# Altium schematic sheet Mcu.SchDoc: Test
size A4; DrawnBy: Łukasz Przeniosło; Organization: Zachodniopomorski; Address1: Uniwersytet Technologiczny; Address2: w Szczecinie; Address3: Wydział Elektryczny; DocumentNumber: 1111; Revision: 1.0; SheetNumber: 0; SheetTotal: 0
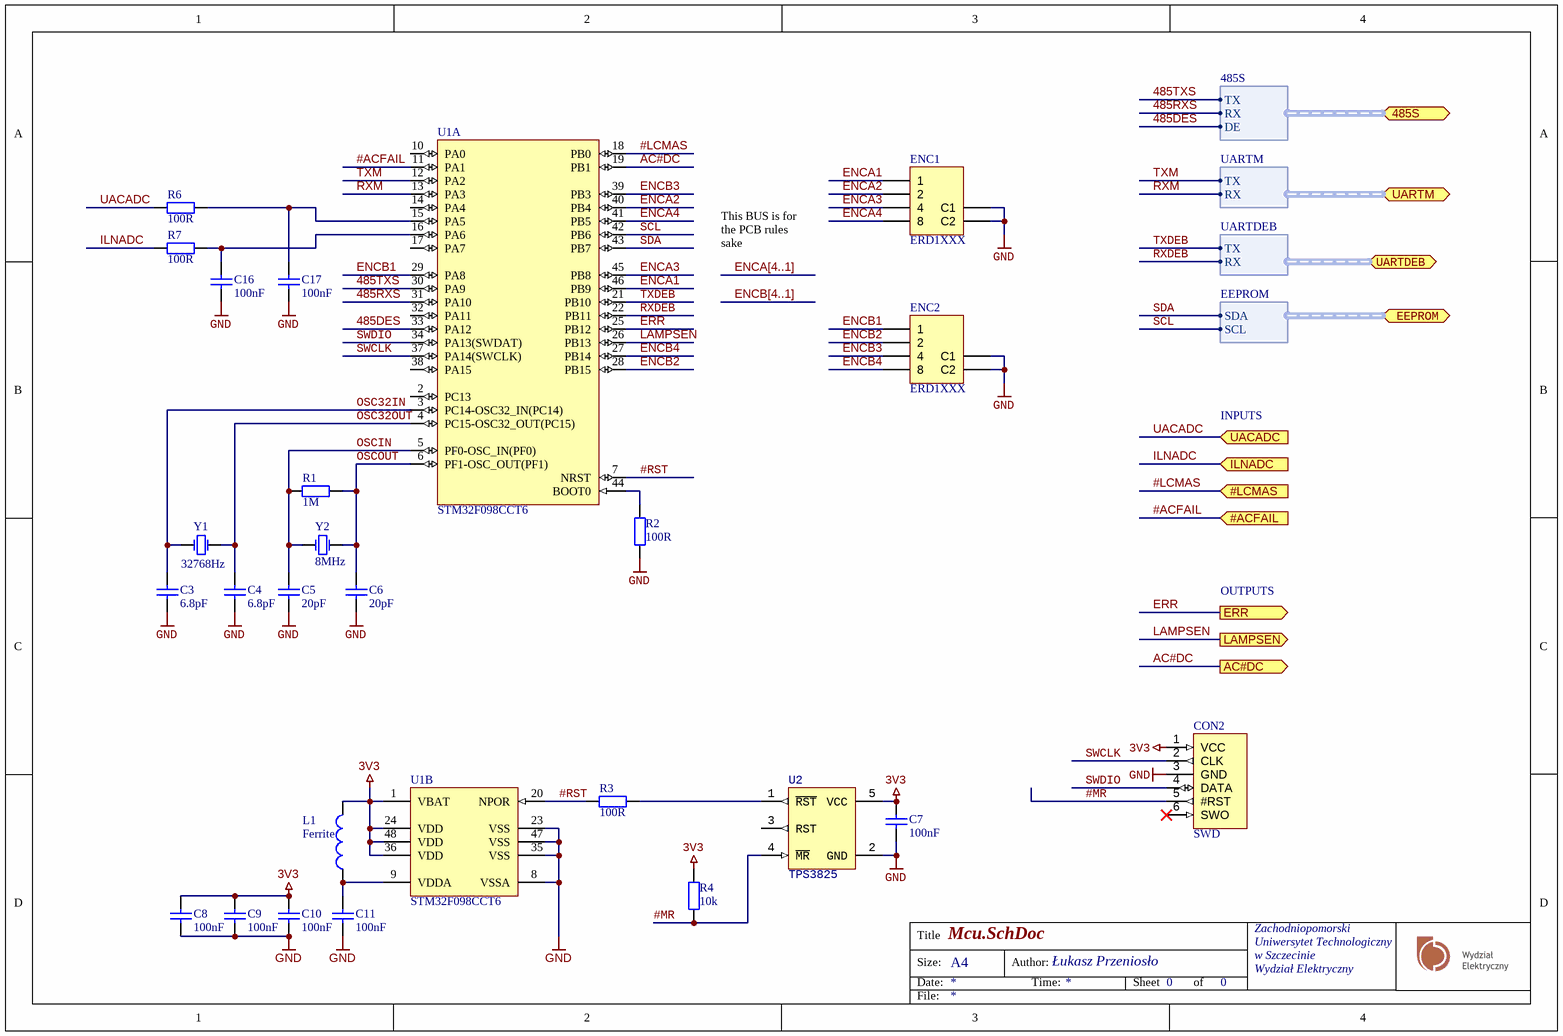
[diagram p0: Mcu.SchDoc]

## Parts
C3  6.8pF  [CAPC1608N]
C4  6.8pF  [CAPC1608N]
C5  20pF  [CAPC1608N]
C6  20pF  [CAPC1608N]
C7  100nF  [CAPC1608N]
C8  100nF  [CAPC1608N]
C9  100nF  [CAPC1608N]
C10  100nF  [CAPC1608N]
C11  100nF  [CAPC1608N]
C16  100nF  [CAPC1608N]
C17  100nF  [CAPC1608N]
CON2  SWD  [HEADER_6]
ENC1  ERD1XXX  [ERD]
ENC2  ERD1XXX  [ERD]
L1  Ferrite  [inductor_0603]
R1  1M  [RESC1608N]
R2  100R  [RESC1608N]
R3  100R  [RESC1608N]
R4  10k  [RESC1608N]
R6  100R  [RESC1608N]
R7  100R  [RESC1608N]
U1  STM32F098CCT6  [LQFP-48_L]  (parts A,B of 2)
U2  TPS3825  [SOT23-5-DBVR]
Y1  32768Hz  [ABS25-crystal]
Y2  8MHz  [HC49/4H_SMX]

## Ports
485S (harness 485S), #ACFAIL (in), #LCMAS (in), AC#DC (out), EEPROM (harness EEPROM), ERR (out), ILNADC (in), LAMPSEN (out), UACADC (in), UARTDEB (harness UARTDEB), UARTM (harness UARTM)

## Harnesses
485S: TX, RX, DE
UARTM: TX, RX
EEPROM: SDA, SCL
UARTDEB: TX, RX

## Nets
3V3: C7.2 C8.2 C9.2 C10.2 CON2.1(VCC) L1.2 R4.1 U1.1(VBAT) U1.24(VDD) U1.36(VDD) U1.48(VDD) U2.5(VCC)
GND: C3.1 C4.1 C5.2 C6.2 C7.1 C8.1 C9.1 C10.1 C11.1 C16.1 C17.2 CON2.3(GND) ENC1.C1 ENC1.C2 ENC2.C1 ENC2.C2 R2.2 U1.8(VSSA) U1.23(VSS) U1.35(VSS) U1.47(VSS) U2.2(GND)
485DES: U1.33(PA12) ; port 485S.DE
485RXS: U1.31(PA10) ; port 485S.RX
485TXS: U1.30(PA9) ; port 485S.TX
#ACFAIL: U1.11(PA1) ; port #ACFAIL
#LCMAS: U1.18(PB0) ; port #LCMAS
#MR: CON2.5(#RST) R4.2 U2.4(~{MR})
#RST: R3.1 U1.7(NRST) U1.20(NPOR)
AC#DC: U1.19(PB1) ; port AC#DC
ENCA1: ENC1.1 U1.46(PB9)
ENCA2: ENC1.2 U1.40(PB4)
ENCA3: ENC1.4 U1.45(PB8)
ENCA4: ENC1.8 U1.41(PB5)
ENCB1: ENC2.1 U1.29(PA8)
ENCB2: ENC2.2 U1.28(PB15)
ENCB3: ENC2.4 U1.39(PB3)
ENCB4: ENC2.8 U1.27(PB14)
ERR: U1.25(PB12) ; port ERR
ILNADC: R7.1 ; port ILNADC
LAMPSEN: U1.26(PB13) ; port LAMPSEN
OSC32IN: C3.2 U1.3(PC14-OSC32_IN(PC14)) Y1.1(OSC1)
OSC32OUT: C4.2 U1.4(PC15-OSC32_OUT(PC15)) Y1.2(OSC2)
OSCIN: C5.1 R1.1 U1.5(PF0-OSC_IN(PF0)) Y2.2(OSC2)
OSCOUT: C6.1 R1.2 U1.6(PF1-OSC_OUT(PF1)) Y2.1(OSC1)
RXDEB: U1.22(PB11) ; port UARTDEB.RX
RXM: U1.13(PA3) ; port UARTM.RX
SCL: U1.42(PB6) ; port EEPROM.SCL
SDA: U1.43(PB7) ; port EEPROM.SDA
SWCLK: CON2.2(CLK) U1.37(PA14(SWCLK))
SWDIO: CON2.4(DATA) U1.34(PA13(SWDAT))
TXDEB: U1.21(PB10) ; port UARTDEB.TX
TXM: U1.12(PA2) ; port UARTM.TX
UACADC: R6.1 ; port UACADC
NetC11_2: C11.2 L1.1 U1.9(VDDA)
NetC16_2: C16.2 R7.2 U1.16(PA6)
NetC17_1: C17.1 R6.2 U1.15(PA5)
NetR2_1: R2.1 U1.44(BOOT0)
NetR3_2: R3.2 U2.1(~{RST})

Not connected (* = marked no-connect by the designer): CON2 6(SWO)*; U1 2(PC13) 10(PA0) 14(PA4) 17(PA7) 32(PA11) 38(PA15); U2 3(RST)

## Buses and harness runs
bus ENCA[4..1]
bus ENCB[4..1]

## Notes on the sheet
- This BUS is for the PCB rules sake
- INPUTS
- OUTPUTS
- Title
- Size:
- Date:
- A4
- Author:
- Time:
- Sheet
- of
- File:

## Library data of the parts
C3-C11 C16 C17 = Capacitor
  C3 C4: Value: 6.8pF
  C5 C6: Value: 20pF
  C7-C11 C16 C17: Value: 100nF
CON2 = SWD-HEADER
L1 = Inductor: Code_IEC: 1005; Value: 10mH; Published: 8-Jun-2000; LatestRevisionDate: 29-May-2009; LatestRevisionNote: IPC-7351 Footprint Added.; PackageReference: 0402-A; Publisher: Altium Limited; PackageDescription: Chip Inductor; Code_JEITA: 0402
R1 = Resistor: Power: 0W; Tolerance: 5%; Value: 1M
R2-R4 R6 R7 = Resistor: Tolerance: 5%; Power: 0W
  R2 R3 R6 R7: Value: 100R
  R4: Value: 10k
U1 = STM32F098CCT6: PartNumber: STM32F051C6T6; Internal RAM Size (kB): 4; Operating Frequency(F) (Processor speed) (MHz): 48; Core: ARM Cortex-M0; FLASH Size (Prog) (kB): 32; Supply Voltage(Vcc) min (V): 2; Packing: Tray; I/Os (High Current): 39; ComponentLink3URL: http://www.st.com/st-web-ui/static/active/en/resource/technical/document/datasheet/DM00058181.pdf; Mounting Technology: Surface Mount; PackageDescription: 48-Pin Low Profile Quad Flat Package, 7 x 7 mm Body, 0.5 mm Pitch; PackageReference: LQFP48; ComponentLink1Description: Manufacturer URL; ComponentLink1URL: http://www.st.com/web/en/home.html; ComponentLink2URL: http://www.st.com/st-web-ui/static/active/en/resource/technical/document/datasheet/DM00039193.pdf; PackageVersion: Rev. 6, 06/2013; ComponentLink2Description: Datasheet; ComponentLink3Description: Package Specification; DatasheetVersion: Rev. 3; PartId: 1
U2 = TPS3825: Układ nadzorujący; procesor, układ nadzorujący; push-pull
Y1 = HC49: ABS25-32.768KHZ; Value: 32768Hz
Y2 = HC49: Value: 8MHz